# EAGLE design linearSensor (EAGLE 7.3.0)
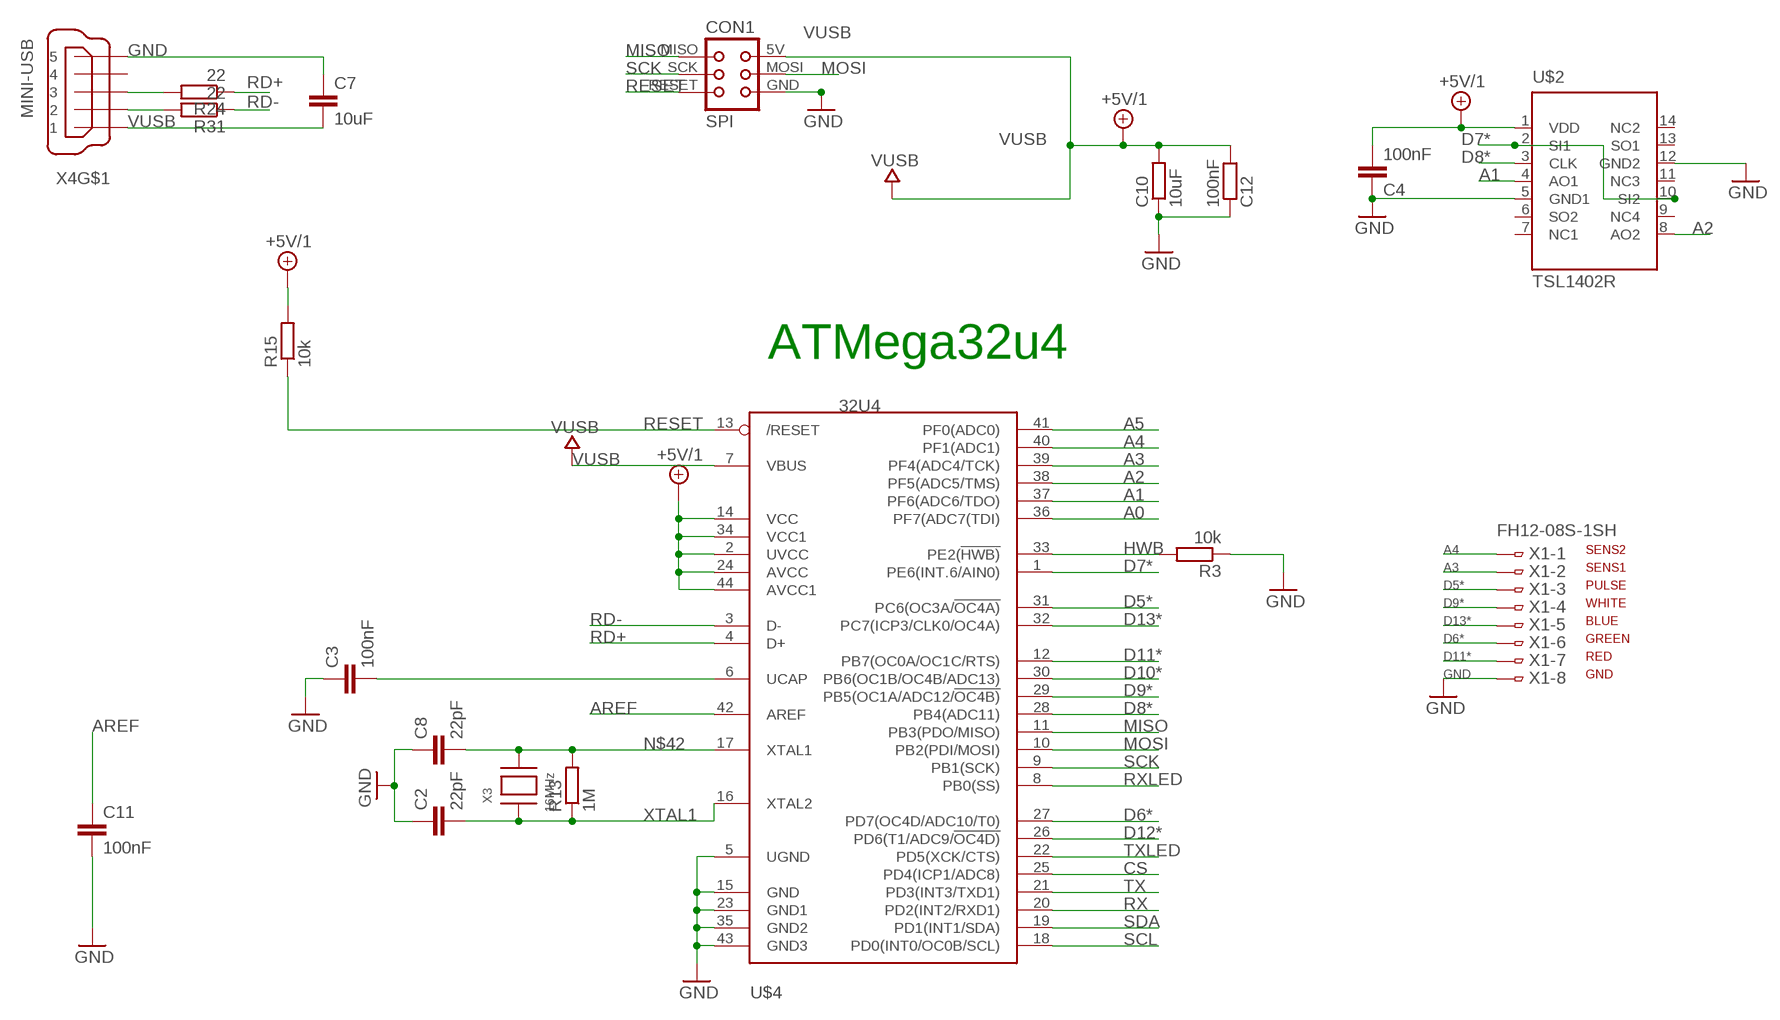
[diagram p0: schematic, sheet 1]

## Parts
C2  22pF  C-EUC0805K  [C0805K]
C3  100nF  C-EUC0805K  [C0805K]
C4  100nF  C-EUC0805  [C0805]
C7  10uF  C-EUC0805  [C0805]
C8  22pF  C-EUC0805K  [C0805K]
C10  10uF  R-EU_M0805  [M0805]
C11  100nF  C-EUC0805K  [C0805K]
C12  100nF  R-EU_M0805  [M0805]
CON1  SPI  TINYISPT  [TC2030-MCP-NL]
R3  10k  R-EU_M0805  [M0805]
R13  1M  R-EU_M0805  [M0805]
R15  10k  R-EU_M0805  [M0805]
R24  22  R-EU_M0805  [M0805]
R31  22  R-EU_M0805  [M0805]
U$2  TSL1402R  [DIL14]
U$4  32U4  ATMEGA32U4-AU  [TQFP44]
X1  FH12-08S-1SH  [FH12-08S-1SH]
X3  16MHz  XTALNX6035  [NX6035]
X4  MINI-USB  MINI-USB-SCHIELD-32005-201  [32005-201]

## Nets
+5V/1 [fine]: C4.2 R15.2 U$2.1(VDD) U$4.2(UVCC) U$4.14(VCC) U$4.24(AVCC) U$4.34(VCC1) U$4.44(AVCC1)
A0: U$4.36(PF7(ADC7(TDI))
A1: U$2.4(AO1) U$4.37(PF6(ADC6/TDO))
A2: U$2.8(AO2) U$4.38(PF5(ADC5/TMS))
A3: U$4.39(PF4(ADC4/TCK)) X1.2
A4: U$4.40(PF1(ADC1)) X1.1
A5: U$4.41(PF0(ADC0))
AREF: C11.1 U$4.42(AREF)
CS: U$4.25(PD4(ICP1/ADC8))
D5*: U$4.31(PC6(OC3A/!OC4A)) X1.3
D6*: U$4.27(PD7(OC4D/ADC10/T0)) X1.6
D7*: U$2.2(SI1) U$2.10(SI2) U$4.1(PE6(INT.6/AIN0))
D8*: U$2.3(CLK) U$4.28(PB4(ADC11))
D9*: U$4.29(PB5(OC1A/ADC12/!OC4B)) X1.4
D10*: U$4.30(PB6(OC1B/OC4B/ADC13))
D11*: U$4.12(PB7(OC0A/OC1C/RTS)) X1.7
D12*: U$4.26(PD6(T1/ADC9/!OC4D))
D13*: U$4.32(PC7(ICP3/CLK0/OC4A)) X1.5
D+USB: R24.2 X4.3
D-USB: R31.2 X4.2
GND [power]: C2.1 C3.1 C4.1 C7.1 C8.1 C10.1 C11.2 C12.1 CON1.GND R3.1 U$2.5(GND1) U$2.12(GND2) U$4.5(UGND) U$4.15(GND) U$4.23(GND1) U$4.35(GND2) U$4.43(GND3) X1.8 X4.5
HWB: R3.2 U$4.33(PE2(!HWB))
MISO: CON1.MISO U$4.11(PB3(PDO/MISO))
MOSI: CON1.MOSI U$4.10(PB2(PDI/MOSI))
N$16: C3.2 U$4.6(UCAP)
N$42: C8.2 R13.2 U$4.17(XTAL1) X3.P$2
RD+: R24.1 U$4.4(D+)
RD-: R31.1 U$4.3(D-)
RESET: CON1.RESET R15.1 U$4.13(/RESET)
RX: U$4.20(PD2(INT2/RXD1))
RXLED: U$4.8(PB0(SS))
SCK: CON1.SCK U$4.9(PB1(SCK))
SCL: U$4.18(PD0(INT0/OC0B/SCL))
SDA: U$4.19(PD1(INT1/SDA))
TX: U$4.21(PD3(INT3/TXD1))
TXLED: U$4.22(PD5(XCK/CTS))
VUSB: C7.2 C10.2 C12.2 CON1.5V(VCC) U$4.7(VBUS) X4.1 ; supply symbol labelled +5V/1
XTAL1: C2.2 R13.1 U$4.16(XTAL2) X3.P$1
Unconnected: U$2.6(SO2) U$2.7(NC1) U$2.9(NC4) U$2.11(NC3) U$2.13(SO1) U$2.14(NC2) X4.4 X4.M1(S:S1) X4.M2(S:S2) X4.M3(S:S3) X4.M4(S:S4)

## Notes on the sheet
- ATMega32u4
- SENS2
- SENS1
- PULSE
- WHITE
- BLUE
- GREEN
- RED
- GND

## Library data of the parts
C2-C4 C7 C8 C11 = rcl:C-EU: CAPACITOR, European symbol
C10 C12 R13 R24 R31 = rcl:R-EU_: RESISTOR, European symbol
CON1 = lpatiny:TINYISP: CONNECTOR
R3 R15 = resistor:R-EU_: RESISTOR, European symbol
U$2 = lpatiny:TSL1402R
U$4 = adafruit:ATMEGA32U4: http://www.ladyada.net/library/eagle
X1 = con-hirose:FH12-08S-1S: 1mm Pitch Connectors For FPC/FFC Source: Data sheet <http://www.hirose.co.jp/cataloge_hp/e58605370.pdf>; OC_FARNELL: unknown; OC_NEWARK: unknown
X3 = lpatiny:XTAL: Low cost SMT crystals, no capacitors included http://www.ladyada.net/library/eagle
X4 = con-cypressindustries:MINI-USB-SCHIELD-: MINI USB-B Conector Source: www.cypressindustries.com; OC_FARNELL: unknown; OC_NEWARK: unknown

## Net classes
0 default: width 0.305 mm
1 power: width 0.457 mm
2 VIN: width 0.457 mm
3 fine: width 0.305 mm
4 aref: width 0.305 mm

## Board
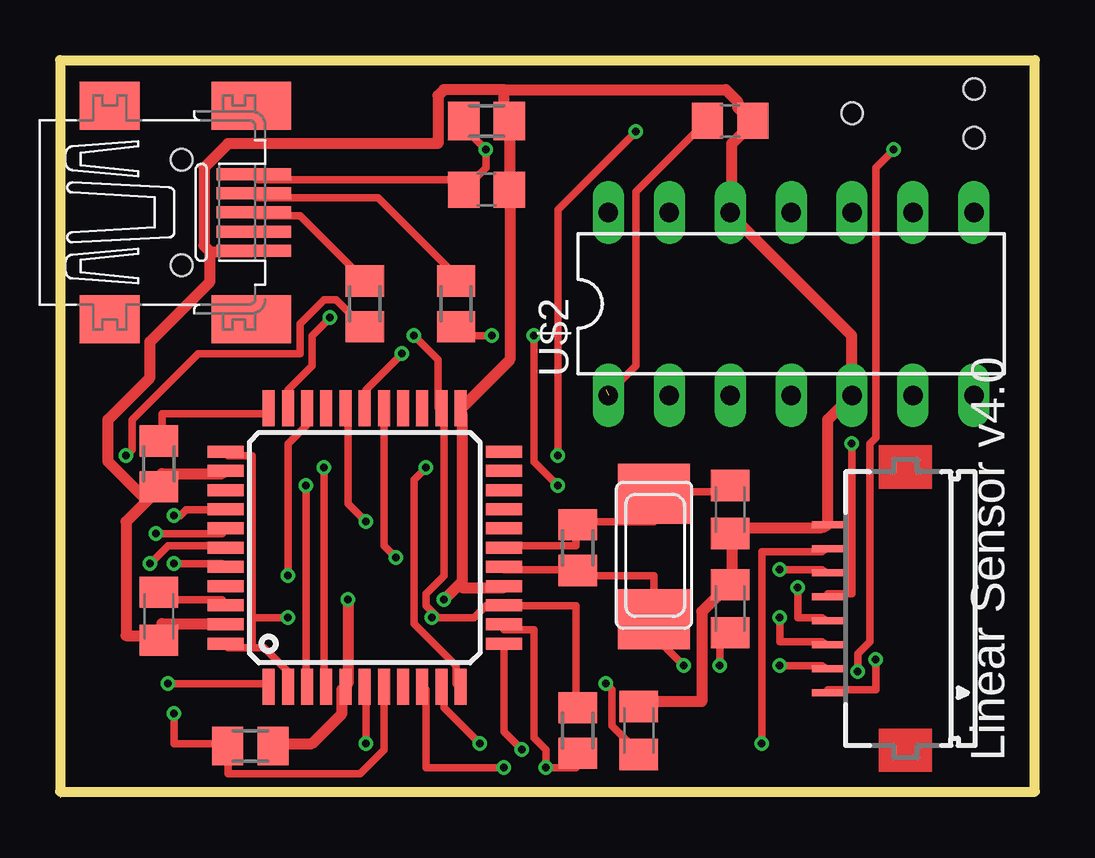
[diagram p1: board, top side]
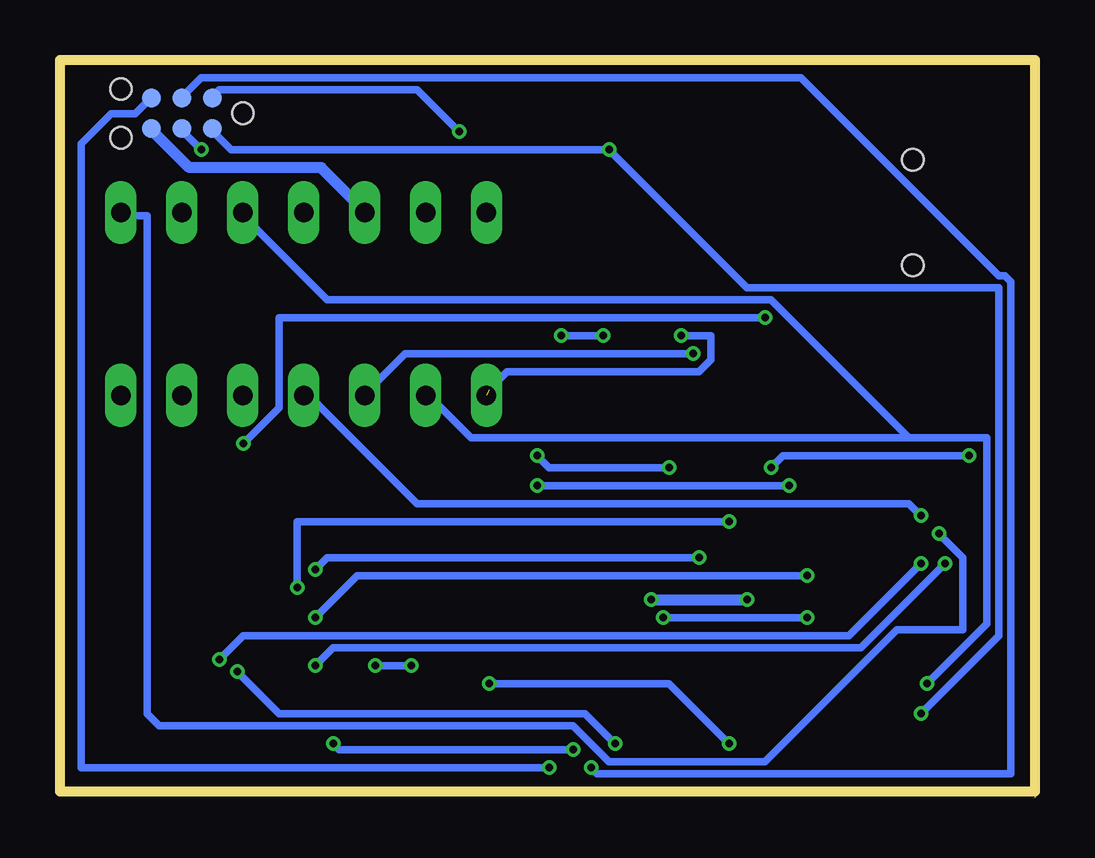
[diagram p2: board, bottom side, seen from below]

Size 40.64 x 30.73 mm. Coordinates in mm from the lower left corner, seen from the top.
Outline: 0,0.25 0,0
Outline: 0,0.25 0,30.73 40.64,30.73 40.64,0.25 0,0.25
Copper layers (1*16): Top 0.035mm / dielectric 1.5mm / Bottom 0.035mm
Design rules "Fusion_eagle_rule_v1.1": minimum track width 6mil, minimum drill 12mil, track to track 6mil, track to pad 6mil, pad to pad 6mil, via to via 6mil, smd to smd 0mil, copper to edge 10mil, drill to drill 10mil, minimum pad ring 10mil, minimum via ring 6mil, stop-mask expansion 2mil, vias tented up to drill 100mil, thermal gap 10mil
vRestrict: area 5.1,2.8 to 20.3,6.6; area 5.1,2.8 to 8.9,16.8; area 16.5,5.3 to 20.3,18; area 5.1,14.2 to 20.3,18

### Footprints (pad centres in the part's own frame; a part is rotated, then mirrored left to right if it is on the bottom)
C0805K = smd 1.3 x 1.6: 1 -1,0; 2 1,0
C0805 = smd 1.3 x 1.5: 1 -0.95,0; 2 0.95,0
M0805 = smd 1.3 x 1.6: 1 -0.95,0; 2 0.95,0
TC2030-MCP-NL = smd 0.787 x 0.787: 5V 1.27,0.635; GND 3.81,0.635; MISO 1.27,-0.635; MOSI 2.54,0.635; RESET 3.81,-0.635; SCK 2.54,-0.635 | hole 0.889: 0,0; 5.08,-1.016; 5.08,1.016
DIL14 = drill 0.813 long: 1 -7.62,-3.81; 2 -5.08,-3.81; 3 -2.54,-3.81; 4 0,-3.81; 5 2.54,-3.81; 6 5.08,-3.81; 7 7.62,-3.81; 8 7.62,3.81; 9 5.08,3.81; 10 2.54,3.81; 11 0,3.81; 12 -2.54,3.81; 13 -5.08,3.81; 14 -7.62,3.81
TQFP44 = smd 1.5 x 0.5: 1 -5.8,4; 2 -5.8,3.2; 3 -5.8,2.4; 4 -5.8,1.6; 5 -5.8,0.8; 6 -5.8,0; 7 -5.8,-0.8; 8 -5.8,-1.6; 9 -5.8,-2.4; 10 -5.8,-3.2; 11 -5.8,-4; 23 5.8,-4; 24 5.8,-3.2; 25 5.8,-2.4; 26 5.8,-1.6; 27 5.8,-0.8; 28 5.8,0; 29 5.8,0.8; 30 5.8,1.6; 31 5.8,2.4; 32 5.8,3.2; 33 5.8,4 | smd 0.5 x 1.5: 12 -4,-5.8; 13 -3.2,-5.8; 14 -2.4,-5.8; 15 -1.6,-5.8; 16 -0.8,-5.8; 17 0,-5.8; 18 0.8,-5.8; 19 1.6,-5.8; 20 2.4,-5.8; 21 3.2,-5.8; 22 4,-5.8; 34 4,5.8; 35 3.2,5.8; 36 2.4,5.8; 37 1.6,5.8; 38 0.8,5.8; 39 0,5.8; 40 -0.8,5.8; 41 -1.6,5.8; 42 -2.4,5.8; 43 -3.2,5.8; 44 -4,5.8
FH12-08S-1SH = smd 0.3 x 1.3: 1 -3.5,3.25; 2 -2.5,3.25; 3 -1.5,3.25; 4 -0.5,3.25; 5 0.5,3.25; 6 1.5,3.25; 7 2.5,3.25; 8 3.5,3.25
NX6035 = smd 2.5 x 3: P$1 2.665,0; P$2 -2.565,0
32005-201 = smd 3.1 x 0.5: 1 3,1.6; 2 3,0.8; 3 3,0; 4 3,-0.8; 5 3,-1.6 | smd 2.5 x 2: M1 -3,-4.45; M2 -3,4.45 | smd 3.3 x 2: M3 2.9,4.45; M4 2.9,-4.45 | hole 0.9: 0,2.2; 0,-2.2

### Placement (x,y rotation side)
C2  27.94,7.87 270 top
C3  24.13,2.79 270 top
C4  27.94,28.19 180 top
C7  17.78,25.34 180 top
C8  27.94,12 90 top
C10  17.78,28.19 180 top
C11  4.13,7.56 270 top
C12  7.94,2.16 180 top
CON1  33.02,28.51 180 bottom
R3  4.13,13.91 90 top
R13  21.59,10.41 90 top
R15  21.59,2.79 90 top
R24  12.7,20.57 90 top
R31  16.51,20.57 90 top
U$2  30.48,20.57 0 top
U$4  12.7,10.41 90 top
X1  35.24,7.87 90 top
X3  24.77,10.1 270 top
X4  5.08,24.38 0 top

### Tracks (layer width: path | path; a pad name or v marks a point on that pad's centre or on a via)
+5V/1  (via drill 0.3)  (1 unrouted)
  Top 0.305: C4.2 26.75,28 24,25.25 24,18 23,17 U$2.1 | U$4.2 9.5,5.25 8.5,6.25 8,6.25 | 8,6.25 7,6.25 U$4.44 | 8,6.25 8,7.5 | 8,7.5 8,14.25 7,14.25 U$4.34 | U$4.14 21.5,8 21.5,3.75 R15.2 | 15.5,7.75 15.75,7.5 17.25,7.5 17.75,8 U$4.14 | 15.5,7.75 15.25,8 15.25,8.5 16,9.25 16,16 U$4.24 15.75,16.25 15.75,18.25 v14.75,19.25 | U$4.14 | v9.5,7.5 8,7.5 | 15.5,7.75 v15.5,7.5
  Bottom 0.305: v15.5,7.5 v9.5,7.5 | 22.75,17 22,17.75 14,17.75 13.5,18.25 13.5,19.25 v14.75,19.25
A1  (via drill 0.3)
  Top 0.305: v4.75,11.75 5,11.75 5.25,12 6.75,12 U$4.37
  Bottom 0.305: v4.75,11.75 5.25,12.25 25.75,12.25 30.25,16.75 U$2.4
A2  (via drill 0.3)
  Top 0.305: v4,11 6.75,11 U$4.38
  Bottom 0.305: v4,11 3,10 3,7 5.75,7 11.25,1.5 17.75,1.5 19.25,3 36.5,3 37,3.5 37,24.25 38,24.25 U$2.8
A3  (via drill 0.3)
  Top 0.305: v30,5.5 31.75,5.5 X1.2 | v3.75,9.75 4.5,10.5 6.75,10.5 U$4.39
  Bottom 0.305: v30,5.5 29.25,6.25 7.25,6.25 v3.75,9.75
A4  (via drill 0.3)
  Top 0.305: v34,5.75 34,4.5 32,4.5 X1.1 | v4.75,9.75 6.75,9.75 U$4.40
  Bottom 0.305: v34,5.75 33,6.75 7.75,6.75 v4.75,9.75
AREF
  Top 0.305: U$4.42 6.75,8.25 4.25,8.25 4.25,8.5 C11.1
D5*  (via drill 0.3)
  Top 0.305: v30,7.5 30,6.5 31.75,6.5 X1.3 | v9.5,9.25 9.5,14.75 10.25,15.5 10.25,16 U$4.31
  Bottom 0.305: v30,7.5 28.25,9.25 v9.5,9.25
D6*  (via drill 0.3)
  Top 0.305: v30,9.5 31.75,9.5 X1.6 | v14,10 13.5,10.5 U$4.27
  Bottom 0.305: v30,9.5 29.5,10 v14,10
D7*  (via drill 0.3)
  Top 0.305: v4.5,4.75 8.5,4.75 U$4.1
  Bottom 0.305: v4.5,4.75 2,7.25 2,15 5.25,15 | 5.25,15 23.5,15 25.25,16.75 U$2.2 | 5.25,15 11,20.75 29.5,20.75 33,24.25 U$2.10
D8*  (via drill 0.3)
  Top 0.305: v14.25,18.5 12.75,17 12.75,16.25 U$4.28
  Bottom 0.305: v14.25,18.5 26.25,18.5 27.75,17 U$2.3
D9*  (via drill 0.3)
  Top 0.305: v30.75,8.75 30.75,7.5 31.75,7.5 X1.4 | v12.75,11.5 12,12.25 12,16 U$4.29
  Bottom 0.305: v30.75,8.75 30.75,11.5 v12.75,11.5
D11*  (via drill 0.3)
  Top 0.305: v29.25,2.25 29.25,10.25 31.75,10.25 X1.7 | v19.25,2 18.5,2.75 U$4.12
  Bottom 0.305: v29.25,2.25 29,2 v19.25,2
D13*  (via drill 0.3)
  Top 0.305: v33,14.75 33,8.5 32,8.5 X1.5 | v11.25,20 10.5,19.25 10.5,18 9.5,17 U$4.32
  Bottom 0.305: v33,14.75 31.5,16.25 31.5,20 v11.25,20
D+USB
  Top 0.305: R24.2 12.5,21.75 10,24.25 8.25,24.25 X4.3
D-USB
  Top 0.305: R31.2 16.5,21.75 13.25,25 8.25,25 X4.2
GND  (via drill 0.3)
  Top 0.457: C3.1 24.25,4 26.75,4 26.75,7.75 27.75,8.75 C2.1 28,9 28,10.75 C8.1 28,11 28,11.25 31.75,11.25 X1.8 32,11.5 32,15.75 33,16.75 U$2.5 33,17 33,19.25 28,24.25 U$2.12 28,24.5 28,27.25 28.75,28 C4.1 28.75,28.25 28.25,28.75 28.25,29 27.75,29.5 18.5,29.5 | U$4.43 6.75,7.25 4.25,7.25 4.25,6.75 C11.2 4,6.75 2.75,6.75 2.75,11.5 4,12.75 R3.1 | U$4.35 6.75,13.5 4.25,13.5 4.25,13 R3.1 | 6.25,22.75 8,22.75 X4.5 | 6.25,22.75 6.25,21.5 3.75,19 3.75,17.5 2,15.75 2,14 3.5,12.5 R3.1 | C12.1 9,2.25 10.5,2.25 11.75,3.5 11.75,4.5 U$4.5 12,4.75 v12,8.25 | 16.75,9 16.75,16 U$4.23 16.75,16.25 18.75,18.25 18.75,25.25 C7.1 18.75,25.5 18.75,28 C10.1 18.5,28.25 18.5,29.5 | 16.75,9 16.75,8.75 18.5,8.75 U$4.15 | 16.75,9 v16,8.25 | 6.25,22.75 6,23 6,26.25 7,27.25 15.75,27.25 15.75,29.25 16,29.5 18.5,29.5
  Bottom 0.457: CON1.GND 36.75,27.75 35.25,26.25 29.75,26.25 28,24.5 U$2.12 | v16,8.25 v12,8.25
HWB
  Top 0.305: U$4.33 8.5,16 4.25,16 4.25,15 R3.2
MISO  (via drill 0.3)
  Top 0.305: v24,27.75 20.75,24.5 v20.75,14.25 | v15.25,13.75 14.75,13.25 14.75,7.25 16.5,5.5 16.5,4.75 U$4.11
  Bottom 0.305: v24,27.75 25.75,29.5 34,29.5 34.25,29.25 CON1.MISO | v20.75,14.25 20.25,13.75 v15.25,13.75
MOSI  (via drill 0.3)
  Top 0.305: v34.75,27 34,26.25 34,15 33.75,14.75 33.75,6.5 33.25,6 v33.25,5.25 | v17.5,2.25 16,3.75 16,4.5 U$4.10
  Bottom 0.305: v34.75,27 35.5,27.75 CON1.MOSI | v33.25,5.25 31.5,3.5 18.75,3.5 v17.5,2.25
N$16  (via drill 0.3)
  Top 0.305: v12.75,2.25 12.75,4.5 U$4.6 | v22.75,4.75 23,4.5 23,3 24,2 C3.2
  Bottom 0.305: v12.75,2.25 15.25,4.75 v22.75,4.75
N$42
  Top 0.305: U$4.17 18.5,10.5 21.5,10.5 21.5,11.25 R13.2 21.75,11.5 24.75,11.5 24.75,12.5 X3.P$2 25,12.75 27.75,12.75 C8.2
RD+  (via drill 0.3)
  Top 0.305: v11,13.75 11,4.75 U$4.4 | v2.75,14.25 3,14.5 3,15.75 5.75,18.5 10,18.5 10,19.75 11,20.75 11.5,20.75 12.5,19.75 R24.1
  Bottom 0.305: v11,13.75 10.5,14.25 v2.75,14.25
RD-  (via drill 0.3)
  Top 0.305: v10.25,13 10.25,4.75 U$4.3 | v20.75,13 19.75,14 v19.75,19.25 | v18,19.25 16.75,19.25 16.75,19.5 R31.1
  Bottom 0.305: v20.75,13 v10.25,13 | v18,19.25 v19.75,19.25
RESET  (via drill 0.3)
  Top 0.305: R15.1 21.5,1.75 21.5,1.25 v20.25,1.25 20.25,2 19.75,2.5 19.75,7 18.5,7 U$4.13
  Bottom 0.305: v20.25,1.25 39.75,1.25 39.75,27.25 38.5,28.5 37.5,28.5 37,29 CON1.RESET
SCK  (via drill 0.3)
  Top 0.305: v18.5,1.25 15.25,1.25 15.25,4.5 U$4.9
  Bottom 0.305: v18.5,1.25 18.25,1 1,1 1,21.5 1.25,21.75 1.5,21.75 9.75,30 34.75,30 35.5,29.25 CON1.SCK
VUSB  (via drill 0.3)
  Top 0.305: U$4.7 13.5,2 12.5,1 7,1 7,2 C12.2 6.75,2.25 4.75,2.25 v4.75,3.5 | C10.2 17,28 17,27.75 v17.75,27 17.75,26.25 17,25.5 C7.2 16.75,25.5 16.75,25.75 8.25,25.75 X4.1
  Bottom 0.305: CON1.5V 34.25,27.75 33.5,27 v17.75,27 12,21.25 1.5,21.25 1.5,6.75 v4.75,3.5
XTAL1  (via drill 0.3)
  Top 0.305: U$4.16 18.5,9.5 21.5,9.5 R13.1 21.75,9.25 24.75,9.25 24.75,7.5 X3.P$1 25,7.25 25,6.5 v26,5.5 | v27.5,5.5 27.5,6.5 27.75,6.75 C2.2
  Bottom 0.305: v26,5.5 v27.5,5.5

### Text on the board
tPlace: Linear Sensor v4.0
203bmp: C:/Users/G/Pictures/logo_epfl.bmp